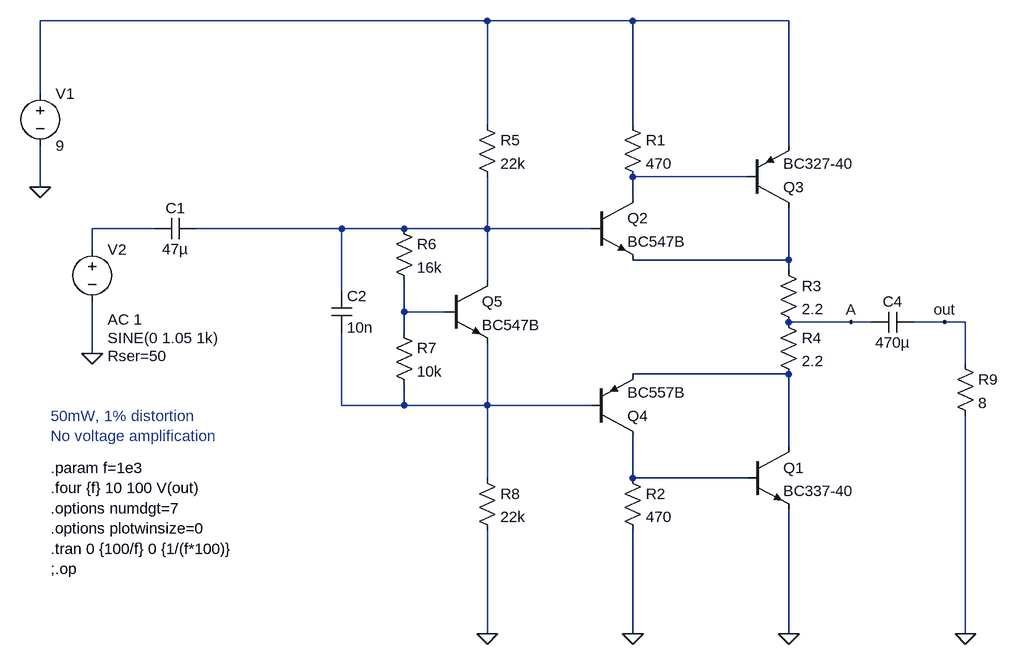
[diagram p0: schematic small_5W_amp.asc]
small_5W_amp.asc, the LTspice schematic file:
Version 4
SHEET 1 1656 680
WIRE 864 -368 176 -368
WIRE 1088 -368 864 -368
WIRE 1328 -368 1088 -368
WIRE 176 -256 176 -368
WIRE 864 -208 864 -368
WIRE 1088 -208 1088 -368
WIRE 1328 -176 1328 -368
WIRE 1264 -128 1088 -128
WIRE 176 -112 176 -176
WIRE 1088 -96 1088 -128
WIRE 352 -48 256 -48
WIRE 640 -48 416 -48
WIRE 736 -48 640 -48
WIRE 864 -48 864 -128
WIRE 864 -48 736 -48
WIRE 1024 -48 864 -48
WIRE 256 -16 256 -48
WIRE 1328 0 1328 -80
WIRE 1328 0 1088 0
WIRE 1328 16 1328 0
WIRE 864 32 864 -48
WIRE 640 48 640 -48
WIRE 736 80 736 32
WIRE 800 80 736 80
WIRE 1424 96 1328 96
WIRE 1456 96 1424 96
WIRE 1568 96 1520 96
WIRE 1600 96 1568 96
WIRE 736 112 736 80
WIRE 256 144 256 64
WIRE 1600 160 1600 96
WIRE 1328 176 1088 176
WIRE 640 224 640 112
WIRE 736 224 736 192
WIRE 736 224 640 224
WIRE 864 224 864 128
WIRE 864 224 736 224
WIRE 1024 224 864 224
WIRE 1328 288 1328 176
WIRE 864 336 864 224
WIRE 1088 336 1088 272
WIRE 1264 336 1088 336
WIRE 864 576 864 416
WIRE 1088 576 1088 416
WIRE 1328 576 1328 384
WIRE 1600 576 1600 240
FLAG 176 -112 0
FLAG 256 144 0
FLAG 1328 576 0
FLAG 1088 576 0
FLAG 864 576 0
FLAG 1600 576 0
FLAG 1568 96 out
FLAG 1424 96 A
SYMBOL npn 1264 288 R0
SYMATTR InstName Q1
SYMATTR Value BC337-40
SYMBOL pnp 1264 -80 M180
SYMATTR InstName Q3
SYMATTR Value BC327-40
SYMBOL voltage 176 -272 R0
SYMATTR InstName V1
SYMATTR Value 9
SYMBOL cap 416 -64 R90
WINDOW 0 0 32 VBottom 2
WINDOW 3 32 32 VTop 2
SYMATTR InstName C1
SYMATTR Value 47µ
SYMBOL voltage 256 -32 R0
WINDOW 3 24 152 Left 2
WINDOW 123 24 124 Left 2
WINDOW 39 24 180 Left 2
SYMATTR Value SINE(0 1.05 1k)
SYMATTR Value2 AC 1
SYMATTR SpiceLine Rser=50
SYMATTR InstName V2
SYMBOL res 1072 -224 R0
SYMATTR InstName R1
SYMATTR Value 470
SYMBOL res 1072 320 R0
SYMATTR InstName R2
SYMATTR Value 470
SYMBOL npn 1024 -96 R0
SYMATTR InstName Q2
SYMATTR Value BC547B
SYMBOL pnp 1024 272 M180
SYMATTR InstName Q4
SYMATTR Value BC557B
SYMBOL res 1312 0 R0
SYMATTR InstName R3
SYMATTR Value 2.2
SYMBOL res 1312 80 R0
SYMATTR InstName R4
SYMATTR Value 2.2
SYMBOL res 848 -224 R0
SYMATTR InstName R5
SYMATTR Value 22k
SYMBOL npn 800 32 R0
SYMATTR InstName Q5
SYMATTR Value BC547B
SYMBOL res 720 -64 R0
SYMATTR InstName R6
SYMATTR Value 16k
SYMBOL res 720 96 R0
SYMATTR InstName R7
SYMATTR Value 10k
SYMBOL cap 624 48 R0
SYMATTR InstName C2
SYMATTR Value 10n
SYMBOL res 848 320 R0
SYMATTR InstName R8
SYMATTR Value 22k
SYMBOL cap 1520 80 R90
WINDOW 0 0 32 VBottom 2
WINDOW 3 32 32 VTop 2
SYMATTR InstName C4
SYMATTR Value 470µ
SYMBOL res 1584 144 R0
SYMATTR InstName R9
SYMATTR Value 8
TEXT 192 320 Left 2 !.param f=1e3\n.four {f} 10 100 V(out)\n.options numdgt=7\n.options plotwinsize=0\n.tran 0 {100/f} 0 {1/(f*100)}\n;.op
TEXT 192 240 Left 2 ;50mW, 1% distortion\nNo voltage amplification

The netlist it stands for:
* small_5W_amp.asc
Q1 N007 N009 0 0 BC337-40
Q3 N005 N002 N001 0 BC327-40
V1 N001 0 9
C1 N004 N003 47µ
V2 N003 0 SINE(0 1.05 1k) AC 1 Rser=50
R1 N001 N002 470
R2 N009 0 470
Q2 N002 N004 N005 0 BC547B
Q4 N009 N008 N007 0 BC557B
R3 N005 A 2.2
R4 A N007 2.2
R5 N001 N004 22k
Q5 N004 N006 N008 0 BC547B
R6 N004 N006 16k
R7 N006 N008 10k
C2 N004 N008 10n
R8 N008 0 22k
C4 out A 470µ
R9 out 0 8
.model NPN NPN
.model PNP PNP
.lib standard.bjt
.param f=1e3
.four {f} 10 100 V(out)
.options numdgt=7
.options plotwinsize=0
.tran 0 {100/f} 0 {1/(f*100)}
;.op
* 50mW, 1% distortion
* No voltage amplification
.backanno
.end